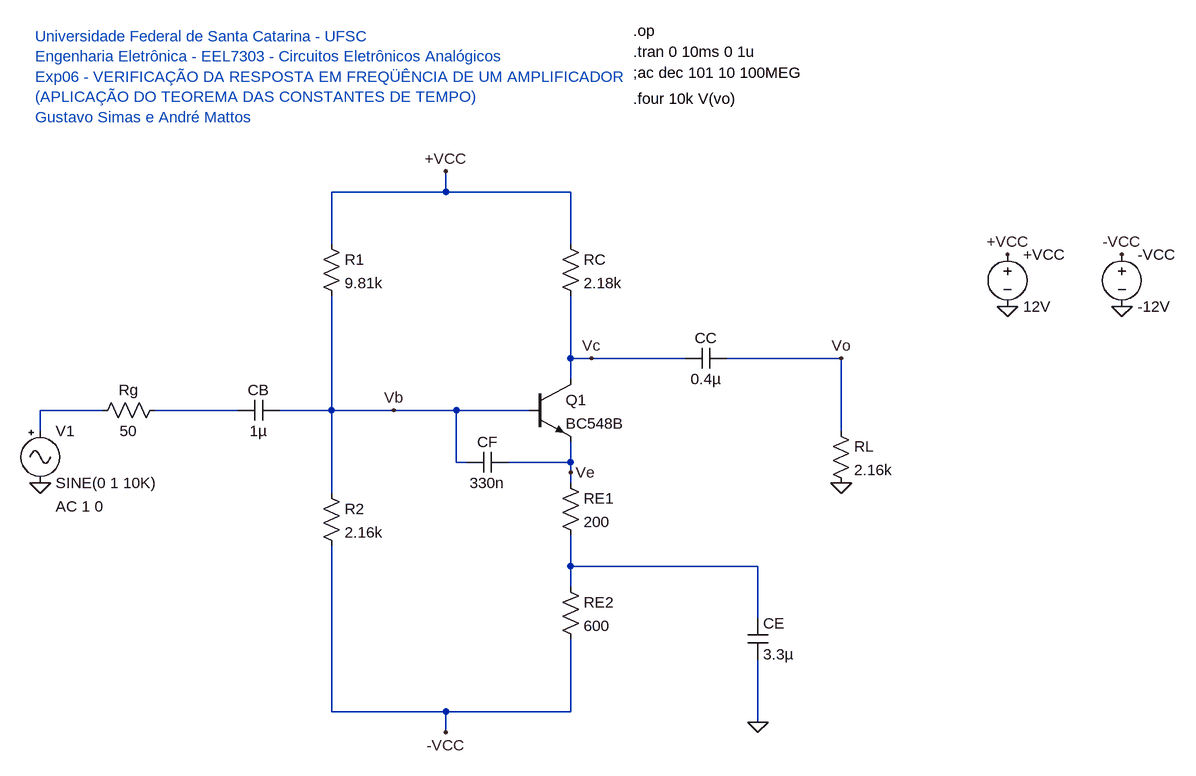
[diagram p0: schematic LAB06.asc]
LAB06.asc, the LTspice schematic file:
Version 4
SHEET 1 2112 1228
WIRE 528 288 528 256
WIRE 528 288 352 288
WIRE 720 288 528 288
WIRE 352 368 352 288
WIRE 720 368 720 288
WIRE 720 544 720 448
WIRE 752 544 720 544
WIRE 896 544 752 544
WIRE 1136 544 960 544
WIRE 720 576 720 544
WIRE 0 624 -96 624
WIRE 208 624 80 624
WIRE 352 624 352 448
WIRE 352 624 272 624
WIRE 448 624 352 624
WIRE 544 624 448 624
WIRE 656 624 544 624
WIRE -96 656 -96 624
WIRE 1136 656 1136 544
WIRE 544 704 544 624
WIRE 560 704 544 704
WIRE 720 704 720 672
WIRE 720 704 624 704
WIRE 720 720 720 704
WIRE 720 736 720 720
WIRE 352 752 352 624
WIRE 720 864 720 816
WIRE 1008 864 720 864
WIRE 720 896 720 864
WIRE 1008 944 1008 864
WIRE 352 1088 352 832
WIRE 528 1088 352 1088
WIRE 720 1088 720 976
WIRE 720 1088 528 1088
WIRE 1008 1104 1008 1008
WIRE 528 1120 528 1088
FLAG 1392 464 0
FLAG 1568 464 0
FLAG 1392 384 +VCC
FLAG 1568 384 -VCC
FLAG -96 736 0
FLAG 1008 1104 0
FLAG 1136 736 0
FLAG 528 256 +VCC
FLAG 528 1120 -VCC
FLAG 1136 544 Vo
FLAG 720 720 Ve
FLAG 448 624 Vb
FLAG 752 544 Vc
SYMBOL Misc\\signal -96 640 R0
WINDOW 123 24 132 Left 2
WINDOW 39 0 0 Left 0
SYMATTR Value2 AC 1 0
SYMATTR InstName V1
SYMATTR Value SINE(0 1 10K)
SYMBOL voltage 1392 368 R0
WINDOW 123 0 0 Left 0
WINDOW 39 0 0 Left 0
SYMATTR InstName +VCC
SYMATTR Value 12V
SYMBOL voltage 1568 368 R0
WINDOW 123 0 0 Left 0
WINDOW 39 0 0 Left 0
SYMATTR InstName -VCC
SYMATTR Value -12V
SYMBOL res 96 608 R90
WINDOW 0 0 56 VBottom 2
WINDOW 3 32 56 VTop 2
SYMATTR InstName Rg
SYMATTR Value 50
SYMBOL npn 656 576 R0
SYMATTR InstName Q1
SYMATTR Value BC548B
SYMBOL res 704 352 R0
SYMATTR InstName RC
SYMATTR Value 2.18k
SYMBOL res 336 352 R0
SYMATTR InstName R1
SYMATTR Value 9.81k
SYMBOL res 336 736 R0
SYMATTR InstName R2
SYMATTR Value 2.16k
SYMBOL res 704 720 R0
SYMATTR InstName RE1
SYMATTR Value 200
SYMBOL res 704 880 R0
SYMATTR InstName RE2
SYMATTR Value 600
SYMBOL res 1120 640 R0
SYMATTR InstName RL
SYMATTR Value 2.16k
SYMBOL cap 560 688 M90
WINDOW 0 0 32 VBottom 2
WINDOW 3 32 32 VTop 2
SYMATTR InstName CF
SYMATTR Value 330n
SYMBOL cap 272 608 R90
WINDOW 0 0 32 VBottom 2
WINDOW 3 32 32 VTop 2
SYMATTR InstName CB
SYMATTR Value 1µ
SYMBOL cap 992 944 R0
SYMATTR InstName CE
SYMATTR Value 3.3µ
SYMBOL cap 960 528 R90
WINDOW 0 0 32 VBottom 2
WINDOW 3 32 32 VTop 2
SYMATTR InstName CC
SYMATTR Value 0.4µ
TEXT -104 48 Left 2 ;Universidade Federal de Santa Catarina - UFSC\nEngenharia Eletrônica - EEL7303 - Circuitos Eletrônicos Analógicos\nExp06 - VERIFICAÇÃO DA RESPOSTA EM FREQÜÊNCIA DE UM AMPLIFICADOR\n(APLICAÇÃO DO TEOREMA DAS CONSTANTES DE TEMPO)\nGustavo Simas e André Mattos
TEXT 816 40 Left 2 !.op
TEXT 816 72 Left 2 !.tran 0 10ms 0 1u
TEXT 816 104 Left 2 !;ac dec 101 10 100MEG
TEXT 816 144 Left 2 !.four 10k V(vo)

The netlist it stands for:
* LAB06.asc
V1 N001 0 SINE(0 1 10K) AC 1 0
V§+VCC +VCC 0 12V
V§-VCC -VCC 0 -12V
Rg N002 N001 50
Q1 Vc Vb Ve 0 BC548B
RC +VCC Vc 2.18k
R1 +VCC Vb 9.81k
R2 Vb -VCC 2.16k
RE1 Ve N003 200
RE2 N003 -VCC 600
RL Vo 0 2.16k
CF Vb Ve 330n
CB Vb N002 1µ
CE N003 0 3.3µ
CC Vo Vc 0.4µ
.model NPN NPN
.model PNP PNP
.lib standard.bjt
* Universidade Federal de Santa Catarina - UFSC
* Engenharia Eletrônica - EEL7303 - Circuitos Eletrônicos Analógicos
* Exp06 - VERIFICAÇÃO DA RESPOSTA EM FREQÜÊNCIA DE UM AMPLIFICADOR
* (APLICAÇÃO DO TEOREMA DAS CONSTANTES DE TEMPO)
* Gustavo Simas e André Mattos
.op
.tran 0 10ms 0 1u
;ac dec 101 10 100MEG
.four 10k V(vo)
.backanno
.end